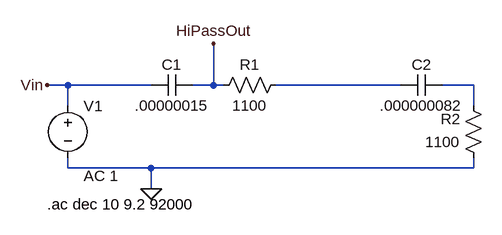
[diagram p0: schematic Bandpass.asc]
Bandpass.asc, the LTspice schematic file:
Version 4
SHEET 1 880 680
WIRE -48 80 -80 80
WIRE 80 80 -48 80
WIRE 176 80 176 16
WIRE 176 80 144 80
WIRE 192 80 176 80
WIRE 464 80 272 80
WIRE 576 80 528 80
WIRE -48 112 -48 80
WIRE 576 112 576 80
WIRE -48 208 -48 192
WIRE 80 208 -48 208
WIRE 576 208 576 192
WIRE 576 208 80 208
WIRE 80 240 80 208
FLAG 80 240 0
FLAG -80 80 Vin
FLAG 176 16 HiPassOut
SYMBOL voltage -48 96 R0
WINDOW 123 24 124 Left 2
WINDOW 39 0 0 Left 0
SYMATTR Value2 AC 1
SYMATTR InstName V1
SYMATTR Value ""
SYMBOL cap 144 64 R90
WINDOW 0 0 32 VBottom 2
WINDOW 3 32 32 VTop 2
SYMATTR InstName C1
SYMATTR Value .00000015
SYMBOL cap 528 64 R90
WINDOW 0 0 32 VBottom 2
WINDOW 3 32 32 VTop 2
SYMATTR InstName C2
SYMATTR Value .000000082
SYMBOL res 288 64 R90
WINDOW 0 0 56 VBottom 2
WINDOW 3 32 56 VTop 2
SYMATTR InstName R1
SYMATTR Value 1100
SYMBOL res 592 208 R180
WINDOW 0 36 76 Left 2
WINDOW 3 36 40 Left 2
SYMATTR InstName R2
SYMATTR Value 1100
TEXT -80 264 Left 2 !.ac dec 10 9.2 92000

The netlist it stands for:
* Bandpass.asc
V1 Vin 0 AC 1
C1 HiPassOut Vin .00000015
C2 N002 N001 .000000082
R1 N001 HiPassOut 1100
R2 0 N002 1100
.ac dec 10 9.2 92000
.backanno
.end